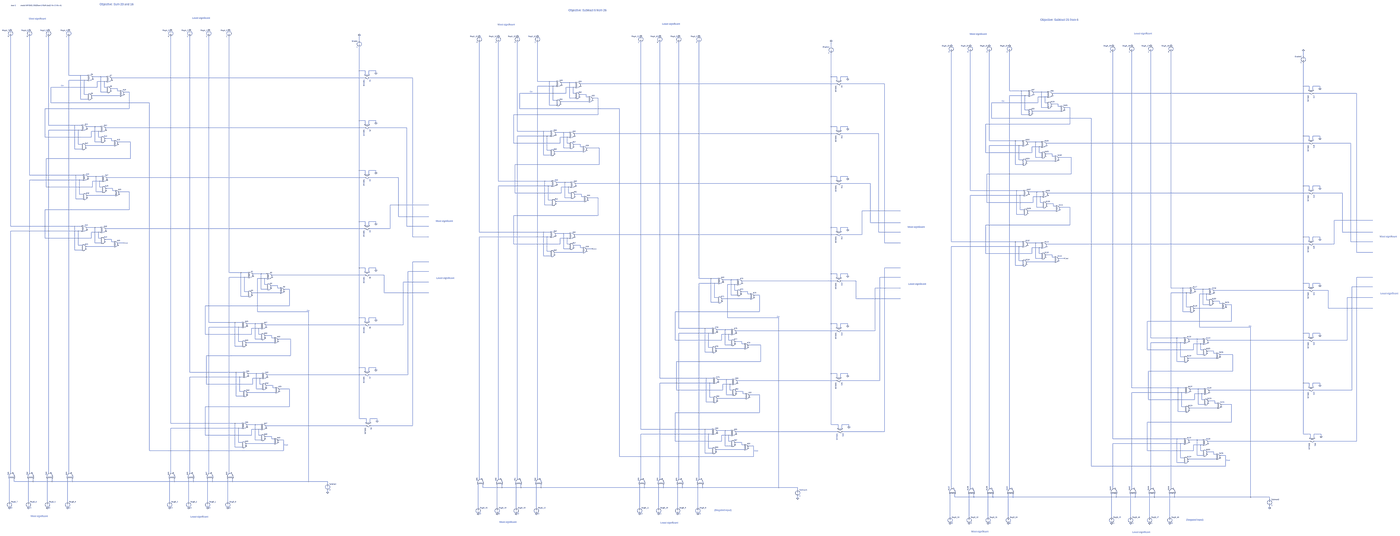
[diagram p0: schematic 8 Bit ALU.asc, whole sheet]
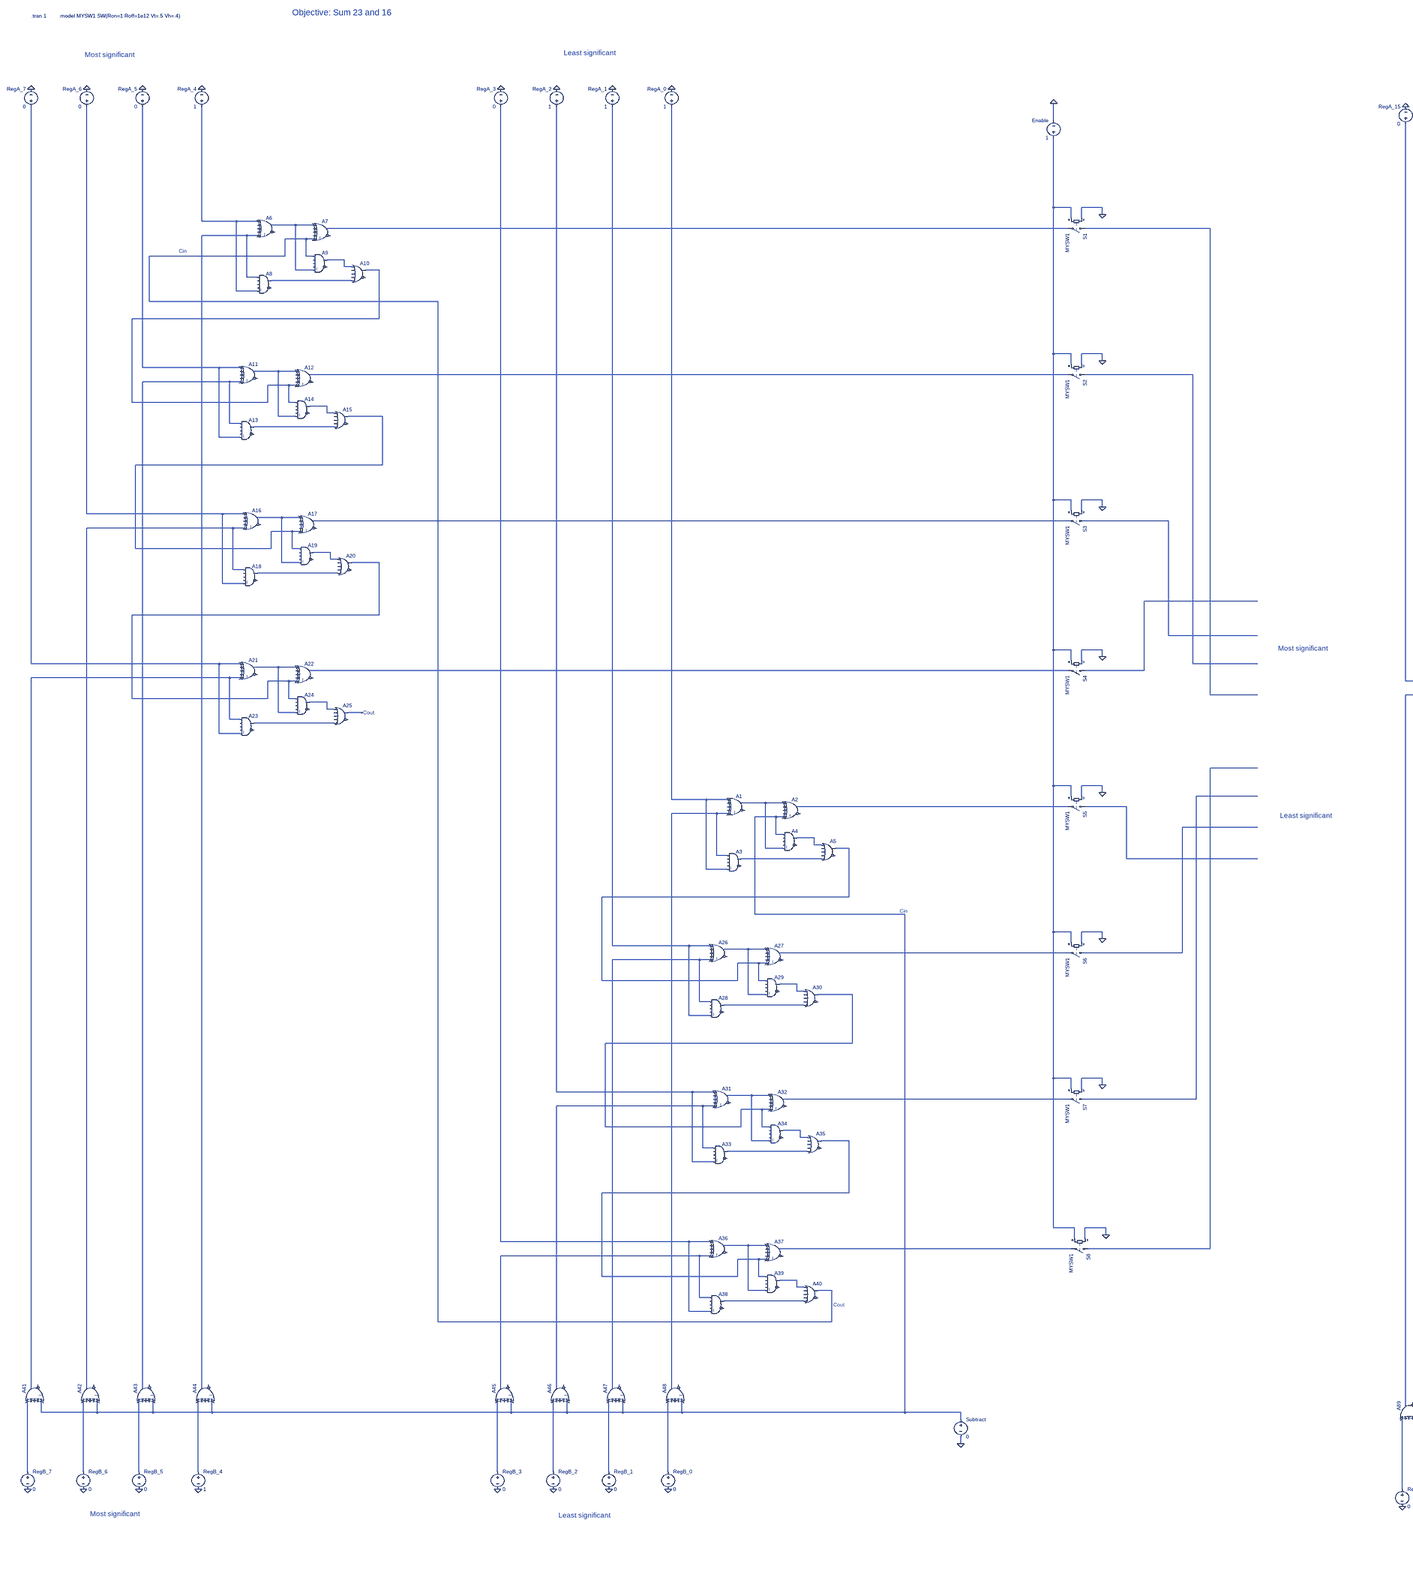
[diagram p1: schematic 8 Bit ALU.asc, part, row 1 of 1, column 1 of 3]
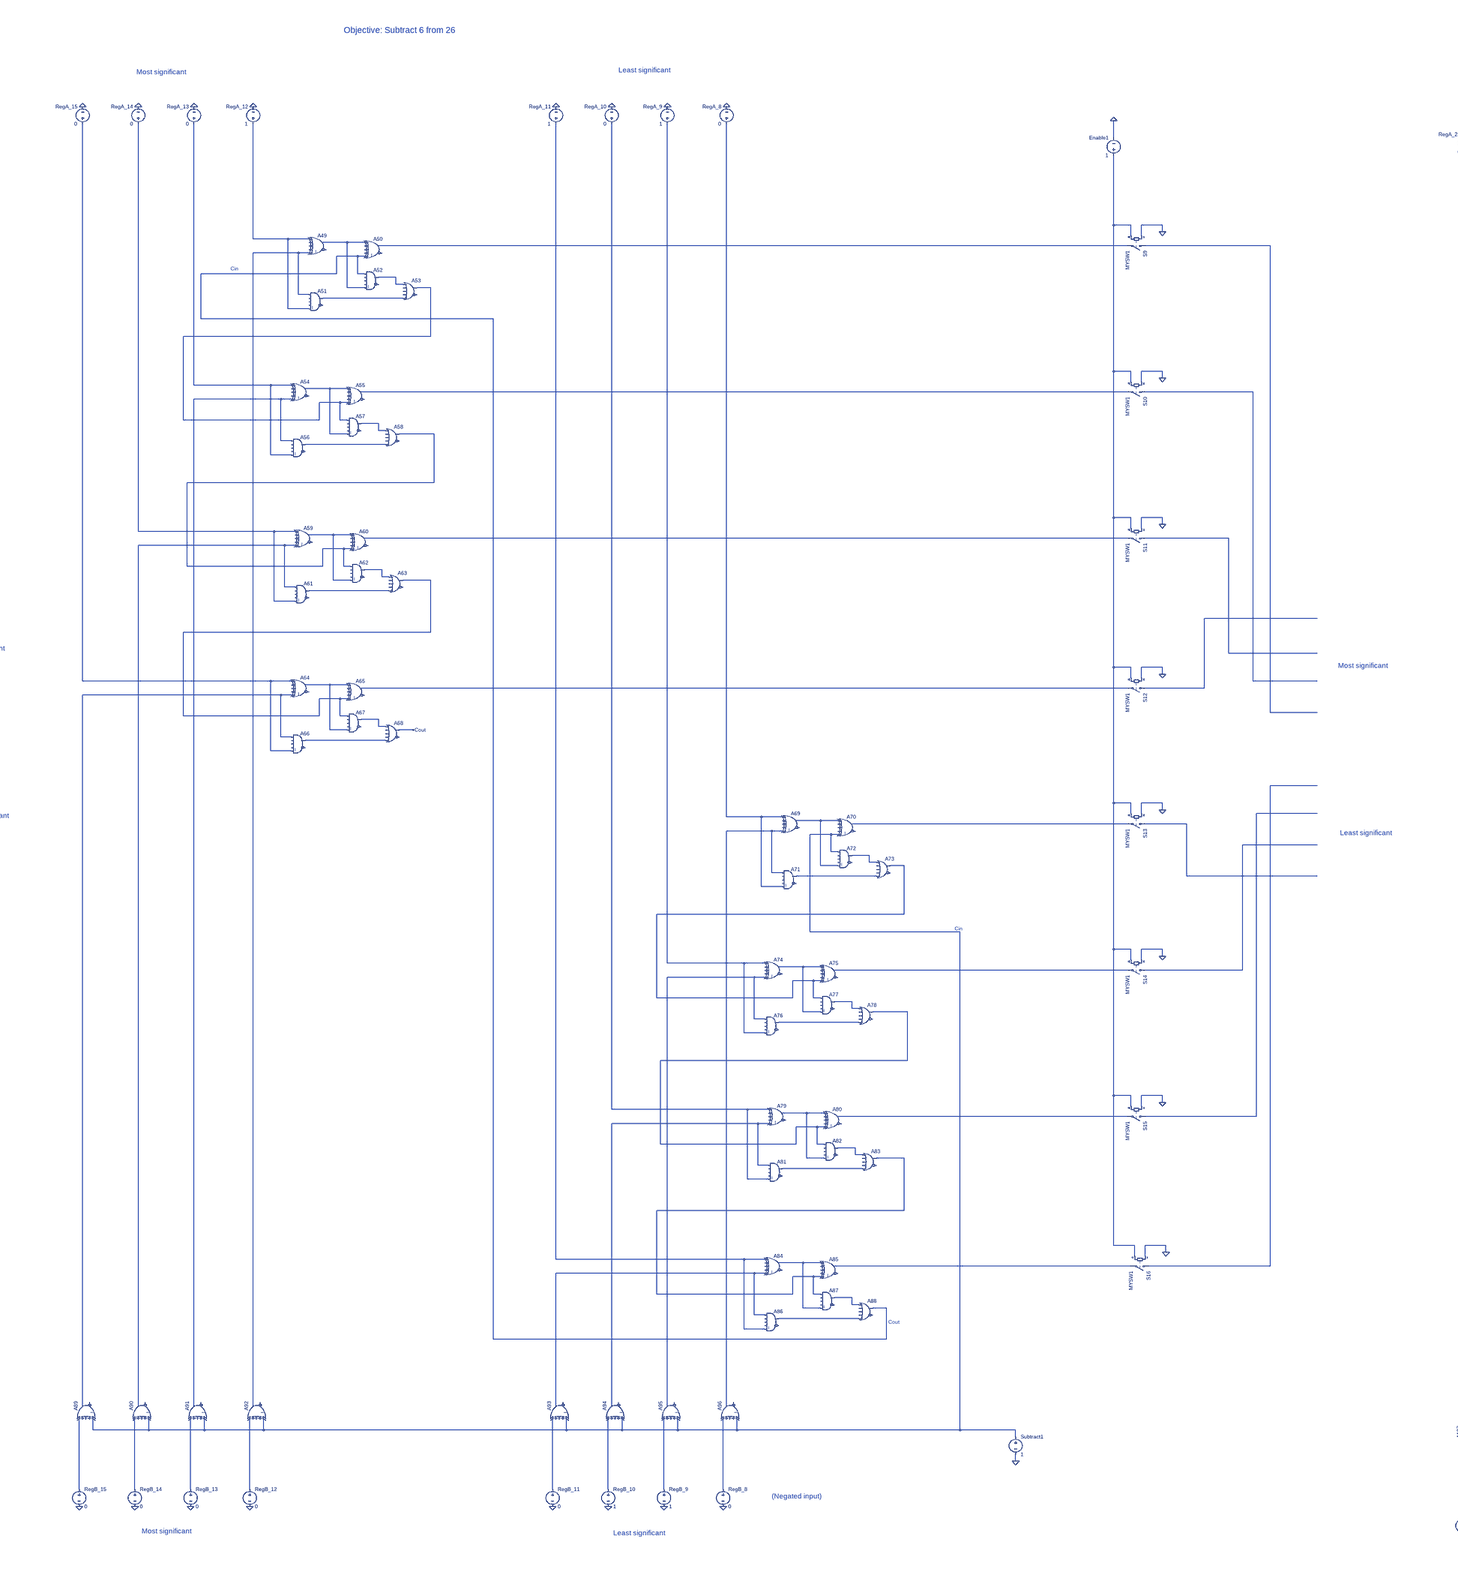
[diagram p2: schematic 8 Bit ALU.asc, part, row 1 of 1, column 2 of 3]
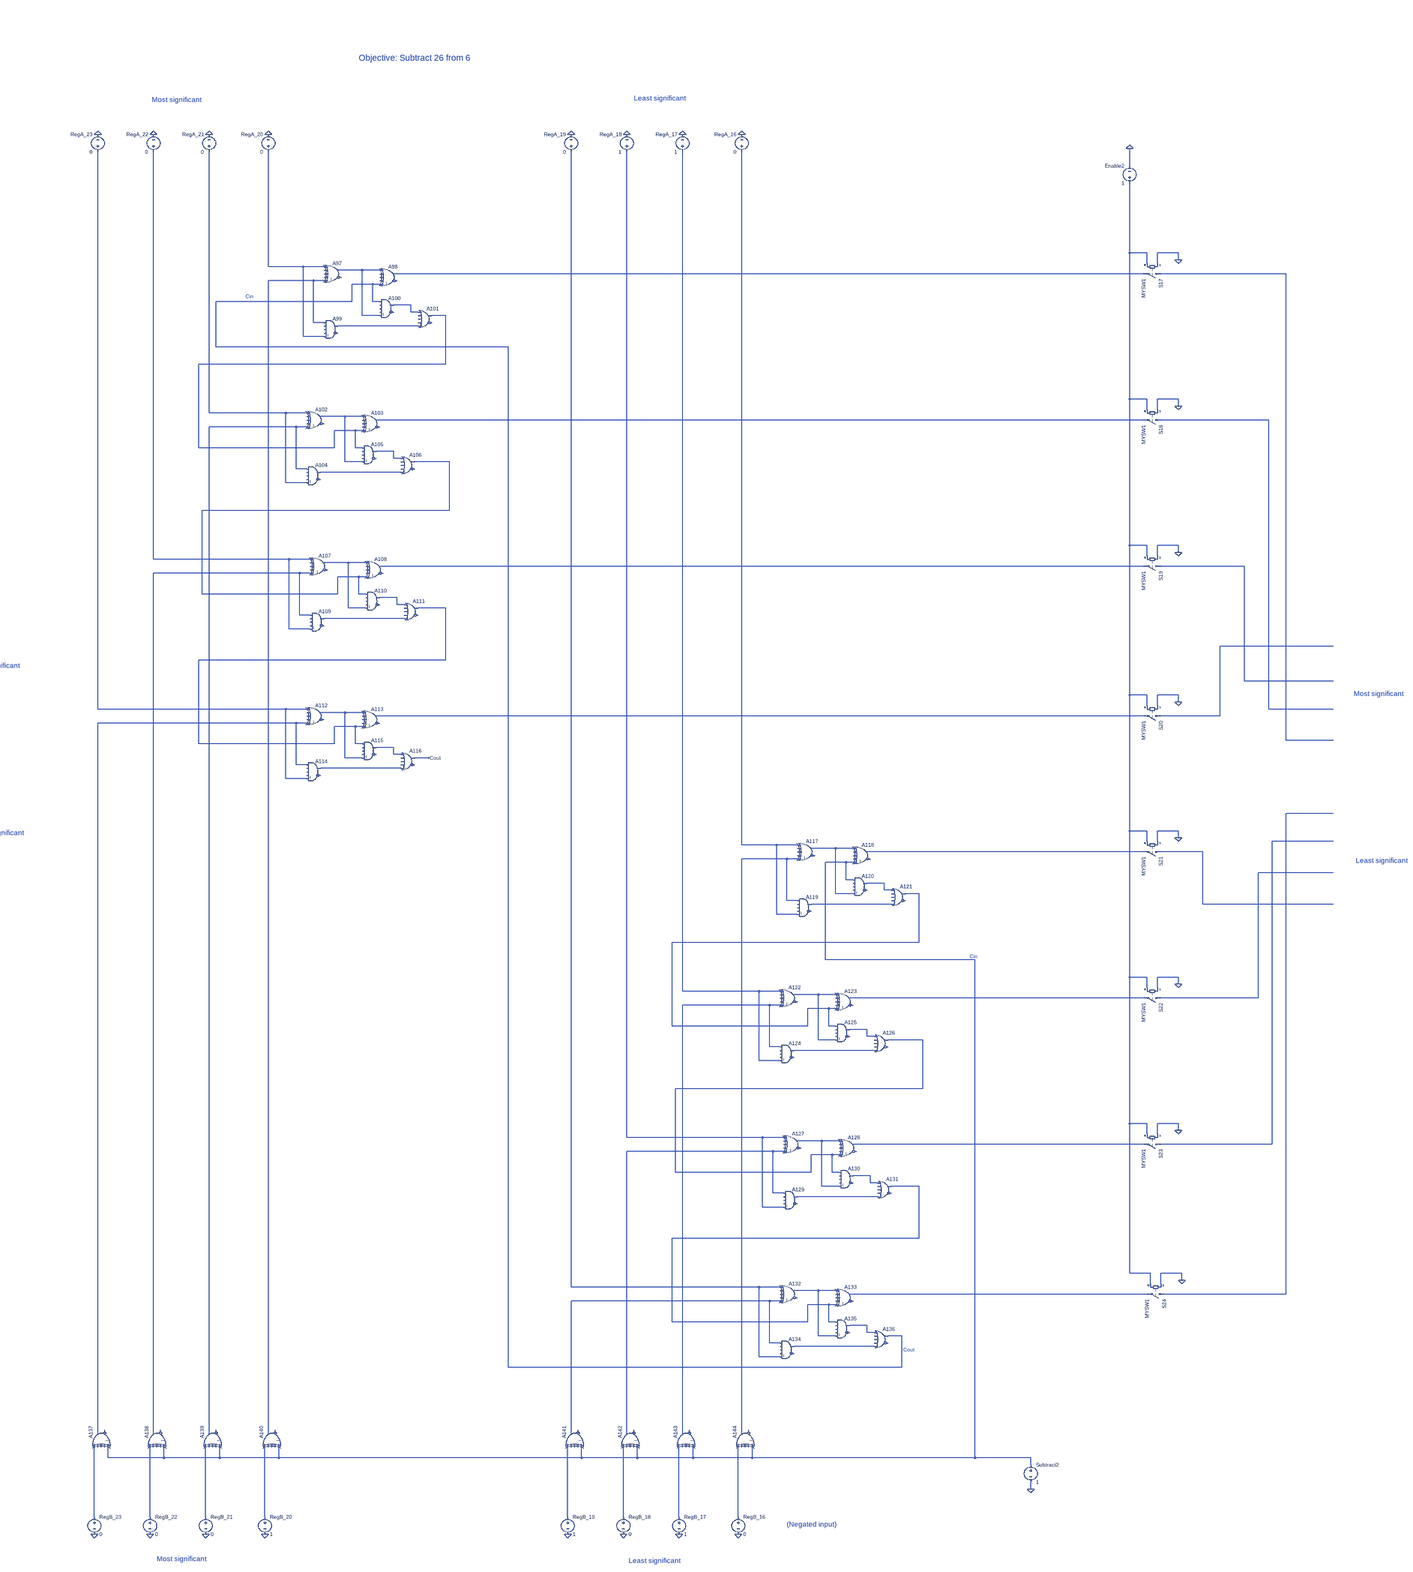
[diagram p3: schematic 8 Bit ALU.asc, part, row 1 of 1, column 3 of 3]
* 8 Bit ALU.asc
A6 N002 0 0 0 N007 0 N003 0 XOR
A7 N003 0 0 0 N008 0 N005 0 XOR
A8 N007 0 0 0 N002 0 N023 0 AND
A9 N008 0 0 0 N003 0 N016 0 AND
A10 N016 0 0 0 N023 0 N018 0 OR
A11 N031 0 0 0 N035 0 N032 0 XOR
A12 N032 0 0 0 N018 0 N033 0 XOR
A13 N035 0 0 0 N031 0 N048 0 AND
A14 N018 0 0 0 N032 0 N041 0 AND
A15 N041 0 0 0 N048 0 N043 0 OR
A16 N055 0 0 0 N059 0 N056 0 XOR
A17 N056 0 0 0 N043 0 N057 0 XOR
A18 N059 0 0 0 N055 0 N072 0 AND
A19 N043 0 0 0 N056 0 N065 0 AND
A20 N065 0 0 0 N072 0 N067 0 OR
A21 N082 0 0 0 N085 0 N083 0 XOR
A22 N083 0 0 0 N067 0 N084 0 XOR
A23 N085 0 0 0 N082 0 N095 0 AND
A24 N067 0 0 0 N083 0 N090 0 AND
A25 N090 0 0 0 N095 0 Cout 0 OR
A1 N103 0 0 0 N107 0 N104 0 XOR
A2 N104 0 0 0 N110 0 N105 0 XOR
A3 N107 0 0 0 N103 0 N127 0 AND
A4 N110 0 0 0 N104 0 N118 0 AND
A5 N118 0 0 0 N127 0 N122 0 OR
A26 N136 0 0 0 N139 0 N137 0 XOR
A27 N137 0 0 0 N122 0 N138 0 XOR
A28 N139 0 0 0 N136 0 N150 0 AND
A29 N122 0 0 0 N137 0 N144 0 AND
A30 N144 0 0 0 N150 0 N146 0 OR
A31 N157 0 0 0 N160 0 N158 0 XOR
A32 N158 0 0 0 N146 0 N159 0 XOR
A33 N160 0 0 0 N157 0 N171 0 AND
A34 N146 0 0 0 N158 0 N165 0 AND
A35 N165 0 0 0 N171 0 N167 0 OR
A36 N178 0 0 0 N181 0 N179 0 XOR
A37 N179 0 0 0 N167 0 N180 0 XOR
A38 N181 0 0 0 N178 0 N191 0 AND
A39 N167 0 0 0 N179 0 N186 0 AND
A40 N186 0 0 0 N191 0 N008 0 OR
V§RegA_0 N103 0 1
V§RegA_1 N136 0 1
V§RegA_2 N157 0 1
V§RegA_3 N178 0 0
V§RegA_4 N002 0 1
V§RegA_5 N031 0 0
V§RegA_6 N055 0 0
V§RegA_7 N082 0 0
A41 N196 0 0 0 N110 0 N085 0 XOR
A42 N197 0 0 0 N110 0 N059 0 XOR
A43 N198 0 0 0 N110 0 N035 0 XOR
A44 N199 0 0 0 N110 0 N007 0 XOR
A45 N200 0 0 0 N110 0 N181 0 XOR
A46 N201 0 0 0 N110 0 N160 0 XOR
A47 N202 0 0 0 N110 0 N139 0 XOR
A48 N203 0 0 0 N110 0 N107 0 XOR
V§RegB_0 N203 0 0
V§RegB_1 N202 0 0
V§RegB_2 N201 0 0
V§RegB_3 N200 0 0
V§RegB_4 N199 0 1
V§RegB_5 N198 0 0
V§RegB_6 N197 0 0
V§RegB_7 N196 0 0
V§Subtract N110 0 0
S1 N006 N005 N001 0 MYSW1
S2 N034 N033 N001 0 MYSW1
S3 N058 N057 N001 0 MYSW1
S4 N077 N084 N001 0 MYSW1
S5 N106 N105 N001 0 MYSW1
S6 N115 N138 N001 0 MYSW1
S7 N102 N159 N001 0 MYSW1
S8 N099 N180 N001 0 MYSW1
V§Enable N001 0 1
A49 N009 0 0 0 N013 0 N010 0 XOR
A50 N010 0 0 0 N015 0 N011 0 XOR
A51 N013 0 0 0 N009 0 N027 0 AND
A52 N015 0 0 0 N010 0 N022 0 AND
A53 N022 0 0 0 N027 0 N026 0 OR
A54 N036 0 0 0 N040 0 N037 0 XOR
A55 N037 0 0 0 N026 0 N038 0 XOR
A56 N040 0 0 0 N036 0 N051 0 AND
A57 N026 0 0 0 N037 0 N047 0 AND
A58 N047 0 0 0 N051 0 N050 0 OR
A59 N060 0 0 0 N064 0 N061 0 XOR
A60 N061 0 0 0 N050 0 N062 0 XOR
A61 N064 0 0 0 N060 0 N075 0 AND
A62 N050 0 0 0 N061 0 N071 0 AND
A63 N071 0 0 0 N075 0 N074 0 OR
A64 N086 0 0 0 N089 0 N087 0 XOR
A65 N087 0 0 0 N074 0 N088 0 XOR
A66 N089 0 0 0 N086 0 N097 0 AND
A67 N074 0 0 0 N087 0 N094 0 AND
A68 N094 0 0 0 N097 0 Cout 0 OR
A69 N111 0 0 0 N116 0 N112 0 XOR
A70 N112 0 0 0 N117 0 N113 0 XOR
A71 N116 0 0 0 N111 0 N132 0 AND
A72 N117 0 0 0 N112 0 N126 0 AND
A73 N126 0 0 0 N132 0 N130 0 OR
A74 N140 0 0 0 N143 0 N141 0 XOR
A75 N141 0 0 0 N130 0 N142 0 XOR
A76 N143 0 0 0 N140 0 N153 0 AND
A77 N130 0 0 0 N141 0 N149 0 AND
A78 N149 0 0 0 N153 0 N152 0 OR
A79 N161 0 0 0 N164 0 N162 0 XOR
A80 N162 0 0 0 N152 0 N163 0 XOR
A81 N164 0 0 0 N161 0 N174 0 AND
A82 N152 0 0 0 N162 0 N170 0 AND
A83 N170 0 0 0 N174 0 N173 0 OR
A84 N182 0 0 0 N185 0 N183 0 XOR
A85 N183 0 0 0 N173 0 N184 0 XOR
A86 N185 0 0 0 N182 0 N193 0 AND
A87 N173 0 0 0 N183 0 N190 0 AND
A88 N190 0 0 0 N193 0 N015 0 OR
V§RegA_8 N111 0 0
V§RegA_9 N140 0 1
V§RegA_10 N161 0 0
V§RegA_11 N182 0 1
V§RegA_12 N009 0 1
V§RegA_13 N036 0 0
V§RegA_14 N060 0 0
V§RegA_15 N086 0 0
A89 N204 0 0 0 N117 0 N089 0 XOR
A90 N205 0 0 0 N117 0 N064 0 XOR
A91 N206 0 0 0 N117 0 N040 0 XOR
A92 N207 0 0 0 N117 0 N013 0 XOR
A93 N208 0 0 0 N117 0 N185 0 XOR
A94 N209 0 0 0 N117 0 N164 0 XOR
A95 N210 0 0 0 N117 0 N143 0 XOR
A96 N211 0 0 0 N117 0 N116 0 XOR
V§RegB_8 N211 0 0
V§RegB_9 N210 0 1
V§RegB_10 N209 0 1
V§RegB_11 N208 0 0
V§RegB_12 N207 0 0
V§RegB_13 N206 0 0
V§RegB_14 N205 0 0
V§RegB_15 N204 0 0
V§Subtract1 N117 0 1
S9 N012 N011 N004 0 MYSW1
S10 N039 N038 N004 0 MYSW1
S11 N063 N062 N004 0 MYSW1
S12 N079 N088 N004 0 MYSW1
S13 N114 N113 N004 0 MYSW1
S14 N120 N142 N004 0 MYSW1
S15 N108 N163 N004 0 MYSW1
S16 N101 N184 N004 0 MYSW1
V§Enable1 N004 0 1
A97 N017 0 0 0 N024 0 N019 0 XOR
A98 N019 0 0 0 N025 0 N020 0 XOR
A99 N024 0 0 0 N017 0 N030 0 AND
A100 N025 0 0 0 N019 0 N028 0 AND
A101 N028 0 0 0 N030 0 N029 0 OR
A102 N042 0 0 0 N049 0 N044 0 XOR
A103 N044 0 0 0 N029 0 N045 0 XOR
A104 N049 0 0 0 N042 0 N054 0 AND
A105 N029 0 0 0 N044 0 N052 0 AND
A106 N052 0 0 0 N054 0 N053 0 OR
A107 N066 0 0 0 N073 0 N068 0 XOR
A108 N068 0 0 0 N053 0 N069 0 XOR
A109 N073 0 0 0 N066 0 N080 0 AND
A110 N053 0 0 0 N068 0 N076 0 AND
A111 N076 0 0 0 N080 0 N078 0 OR
A112 N091 0 0 0 N096 0 N092 0 XOR
A113 N092 0 0 0 N078 0 N093 0 XOR
A114 N096 0 0 0 N091 0 N100 0 AND
A115 N078 0 0 0 N092 0 N098 0 AND
A116 N098 0 0 0 N100 0 Cout 0 OR
A117 N121 0 0 0 N128 0 N123 0 XOR
A118 N123 0 0 0 N129 0 N124 0 XOR
A119 N128 0 0 0 N121 0 N135 0 AND
A120 N129 0 0 0 N123 0 N133 0 AND
A121 N133 0 0 0 N135 0 N134 0 OR
A122 N145 0 0 0 N151 0 N147 0 XOR
A123 N147 0 0 0 N134 0 N148 0 XOR
A124 N151 0 0 0 N145 0 N156 0 AND
A125 N134 0 0 0 N147 0 N154 0 AND
A126 N154 0 0 0 N156 0 N155 0 OR
A127 N166 0 0 0 N172 0 N168 0 XOR
A128 N168 0 0 0 N155 0 N169 0 XOR
A129 N172 0 0 0 N166 0 N177 0 AND
A130 N155 0 0 0 N168 0 N175 0 AND
A131 N175 0 0 0 N177 0 N176 0 OR
A132 N187 0 0 0 N192 0 N188 0 XOR
A133 N188 0 0 0 N176 0 N189 0 XOR
A134 N192 0 0 0 N187 0 N195 0 AND
A135 N176 0 0 0 N188 0 N194 0 AND
A136 N194 0 0 0 N195 0 N025 0 OR
V§RegA_16 N121 0 0
V§RegA_17 N145 0 1
V§RegA_18 N166 0 1
V§RegA_19 N187 0 0
V§RegA_20 N017 0 0
V§RegA_21 N042 0 0
V§RegA_22 N066 0 0
V§RegA_23 N091 0 0
A137 N212 0 0 0 N129 0 N096 0 XOR
A138 N213 0 0 0 N129 0 N073 0 XOR
A139 N214 0 0 0 N129 0 N049 0 XOR
A140 N215 0 0 0 N129 0 N024 0 XOR
A141 N216 0 0 0 N129 0 N192 0 XOR
A142 N217 0 0 0 N129 0 N172 0 XOR
A143 N218 0 0 0 N129 0 N151 0 XOR
A144 N219 0 0 0 N129 0 N128 0 XOR
V§RegB_16 N219 0 0
V§RegB_17 N218 0 1
V§RegB_18 N217 0 0
V§RegB_19 N216 0 1
V§RegB_20 N215 0 1
V§RegB_21 N214 0 0
V§RegB_22 N213 0 0
V§RegB_23 N212 0 0
V§Subtract2 N129 0 1
S17 N021 N020 N014 0 MYSW1
S18 N046 N045 N014 0 MYSW1
S19 N070 N069 N014 0 MYSW1
S20 N081 N093 N014 0 MYSW1
S21 N125 N124 N014 0 MYSW1
S22 N131 N148 N014 0 MYSW1
S23 N119 N169 N014 0 MYSW1
S24 N109 N189 N014 0 MYSW1
V§Enable2 N014 0 1
.tran 1
* Cin
* Cout
* Cin
.model MYSW1 SW(Ron=1 Roff=1e12 Vt=.5 Vh=.4)
* Objective: Sum 23 and 16
* Least significant
* Most significant
* Least significant
* Most significant
* Least significant
* Most significant
* Cin
* Cout
* Cin
* Objective: Subtract 6 from 26
* Least significant
* Most significant
* Least significant
* Most significant
* Least significant
* Most significant
* (Negated input)
* Cin
* Cout
* Cin
* Objective: Subtract 26 from 6
* Least significant
* Most significant
* Least significant
* Most significant
* Least significant
* Most significant
* (Negated input)
.backanno
.end